# EAGLE design humidor_controller_v35 (EAGLE 6.2)
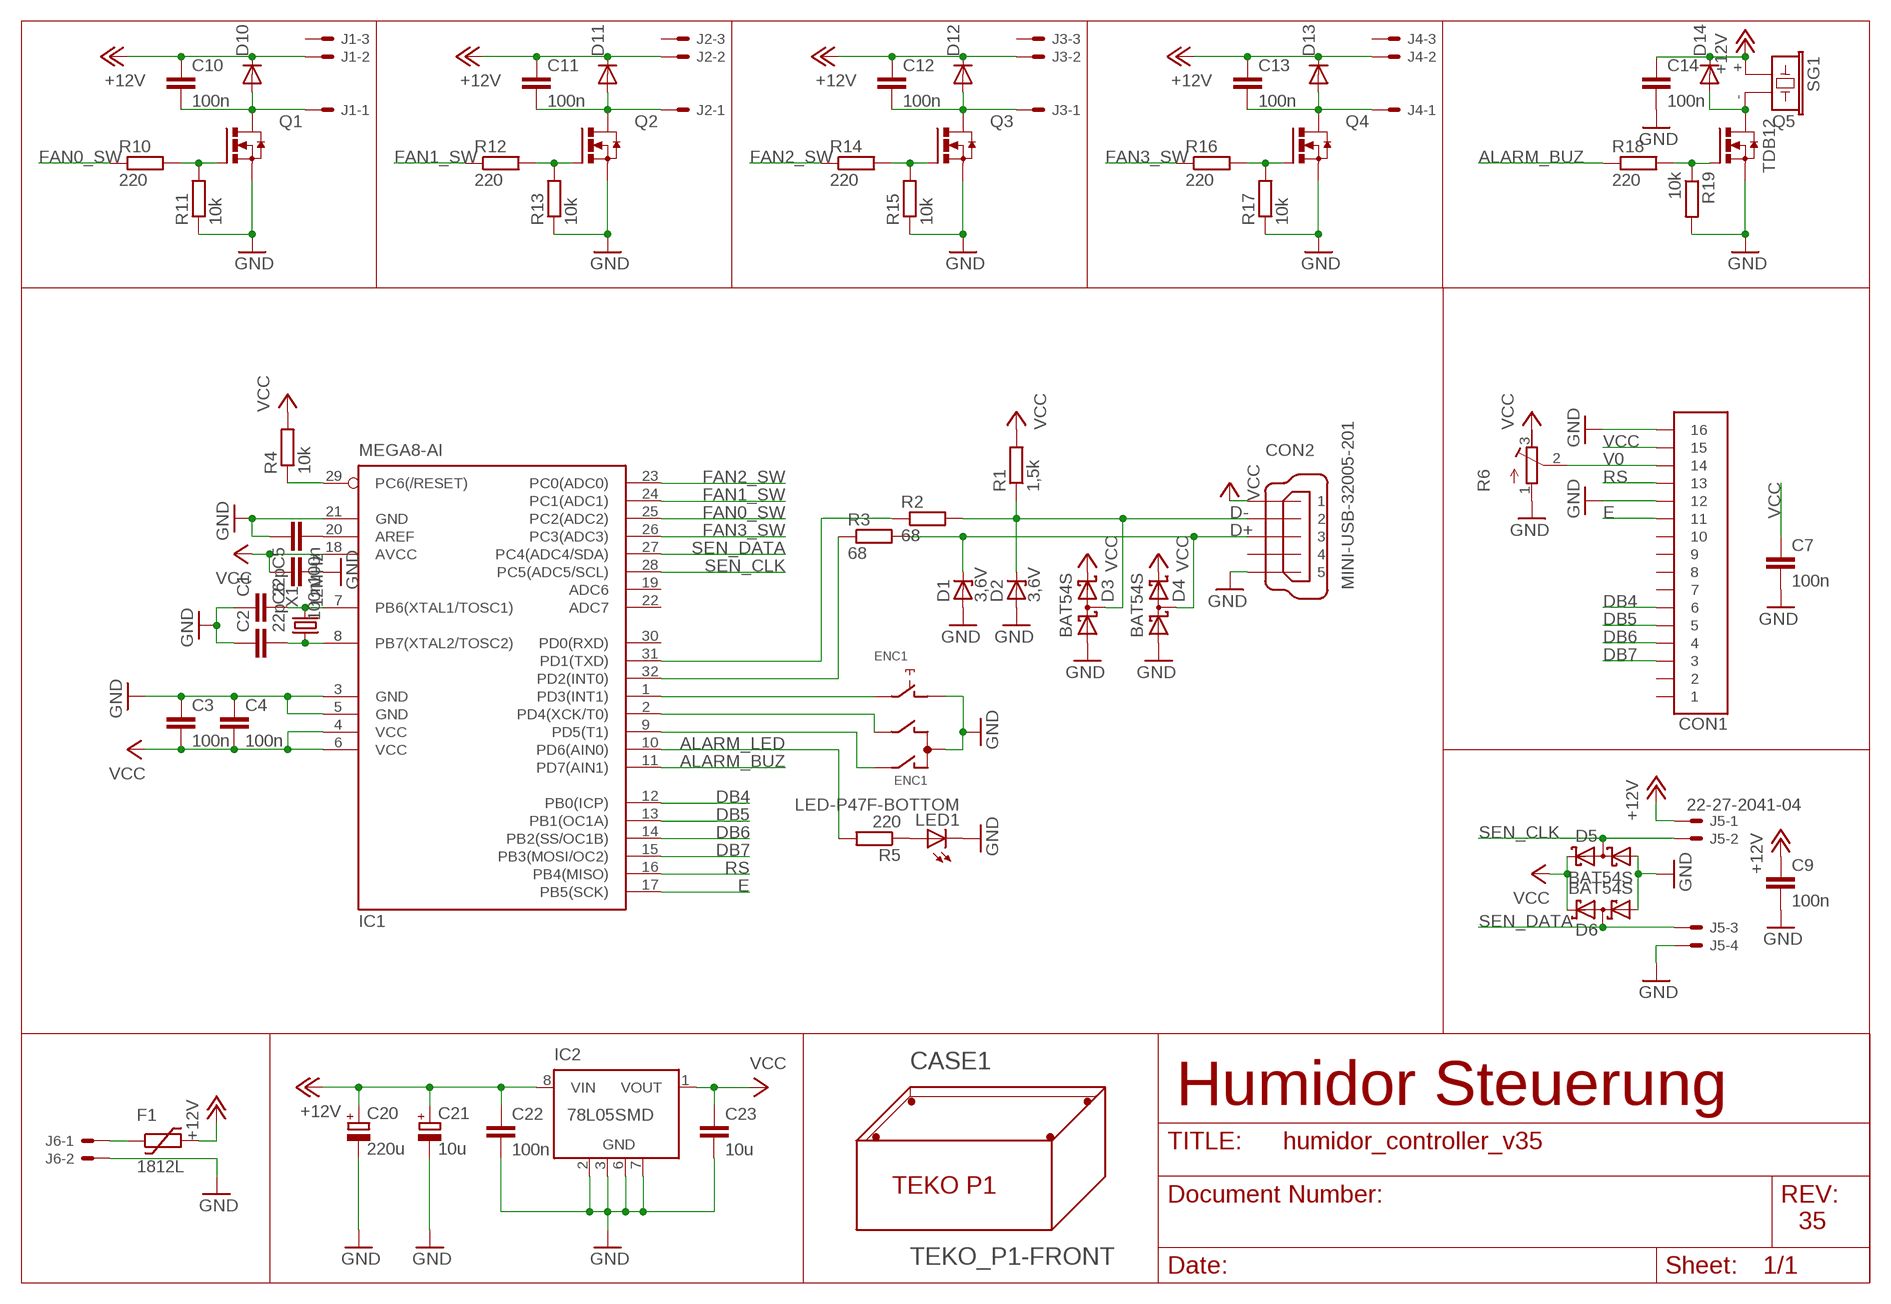
[diagram p0: schematic, sheet 1]

## Parts
C1  22p  C-EUC0805  [C0805]
C2  22p  C-EUC0805  [C0805]
C3  100n  C-EUC0805  [C0805]
C4  100n  C-EUC0805  [C0805]
C5  100n  C-EUC0805  [C0805]
C6  100n  C-EUC0805  [C0805]
C7  100n  C-EUC0805  [C0805]
C9  100n  C-EUC0805  [C0805]
C10  100n  C-EUC0805  [C0805]
C11  100n  C-EUC0805  [C0805]
C12  100n  C-EUC0805  [C0805]
C13  100n  C-EUC0805  [C0805]
C14  100n  C-EUC0805  [C0805]
C20  220u  CPOL-EUG  [PANASONIC_G]
C21  10u  CPOL-EUB  [PANASONIC_B]
C22  100n  C-EUC0805  [C0805]
C23  10u  C-EUC0805  [C0805]
CASE1  TEKO_P1-FRONT  [TEKO_P1_FRONT]
CON1  52207-16  [52207-16]
CON2  MINI-USB-32005-201  [32005-201]
D1  3,6V  ZENER-DIODESOD80C  [SOD80C]
D2  3,6V  ZENER-DIODESOD80C  [SOD80C]
D3  BAT54S  [SOT23]
D4  BAT54S  [SOT23]
D5  BAT54S  [SOT23]
D6  BAT54S  [SOT23]
D10  DIODE-SOD123  [SOD123]
D11  DIODE-SOD123  [SOD123]
D12  DIODE-SOD123  [SOD123]
D13  DIODE-SOD123  [SOD123]
D14  DIODE-SOD123  [SOD123]
ENC1  NOBLE_RE0124  [RE0124]
F1  1812L  [1812L]
IC1  MEGA8-AI  [TQFP32-08]
IC2  78L05SMD  [SO08]
J1  22-27-2031-03  [6410-03]
J2  22-27-2031-03  [6410-03]
J3  22-27-2031-03  [6410-03]
J4  22-27-2031-03  [6410-03]
J5  22-27-2041-04  [6410-04]
J6  22-27-2021-02  [6410-02]
LED1  LED-P47F-BOTTOM  [P47F-BOTTOM]
Q1  N-HEXFET_SOT23-IRLML2502  [SOT23]
Q2  N-HEXFET_SOT23-IRLML2502  [SOT23]
Q3  N-HEXFET_SOT23-IRLML2502  [SOT23]
Q4  N-HEXFET_SOT23-IRLML2502  [SOT23]
Q5  N-HEXFET_SOT23-IRLML2502  [SOT23]
R1  1,5k  R-EU_R0805  [R0805]
R2  68  R-EU_R0805  [R0805]
R3  68  R-EU_R0805  [R0805]
R4  10k  R-EU_R0805  [R0805]
R5  220  R-EU_R0805  [R0805]
R6  R-TRIMM4G/J  [RTRIM4G/J]
R10  220  R-EU_R0805  [R0805]
R11  10k  R-EU_R0805  [R0805]
R12  220  R-EU_R0805  [R0805]
R13  10k  R-EU_R0805  [R0805]
R14  220  R-EU_R0805  [R0805]
R15  10k  R-EU_R0805  [R0805]
R16  220  R-EU_R0805  [R0805]
R17  10k  R-EU_R0805  [R0805]
R18  220  R-EU_R0805  [R0805]
R19  10k  R-EU_R0805  [R0805]
SG1  TDB12  [TDB]
X1  12MHz  CRYSTALHC49UP  [HC49UP]

## Nets
+12V: C9.1 C10.1 C11.1 C12.1 C13.1 C14.1 C20.+ C21.+ C22.1 D10.C D11.C D12.C D13.C D14.C F1.P$2 IC2.8(VIN) J1.2 J2.2 J3.2 J4.2 J5.1 SG1.+
ALARM_BUZ: IC1.11(PD7(AIN1)) R18.1
ALARM_LED: IC1.10(PD6(AIN0)) R5.2
D+: CON2.3 D1.C D4.3(C1A2) R3.2
D-: CON2.2 D2.C D3.3(C1A2) R1.1 R2.2
DB4: CON1.6 IC1.12(PB0(ICP))
DB5: CON1.5 IC1.13(PB1(OC1A))
DB6: CON1.4 IC1.14(PB2(SS/OC1B))
DB7: CON1.3 IC1.15(PB3(MOSI/OC2))
E: CON1.11 IC1.17(PB5(SCK))
FAN0_CS: C10.2 D10.A J1.1 Q1.3(D)
FAN0_SW: IC1.25(PC2(ADC2)) R10.1
FAN1_CS: C11.2 D11.A J2.1 Q2.3(D)
FAN1_SW: IC1.24(PC1(ADC1)) R12.1
FAN2_CS: C12.2 D12.A J3.1 Q3.3(D)
FAN2_CS1: C13.2 D13.A J4.1 Q4.3(D)
FAN2_SW: IC1.23(PC0(ADC0)) R14.1
FAN3_SW: IC1.26(PC3(ADC3)) R16.1
GND: C1.1 C2.1 C3.1 C4.1 C5.1 C6.2 C7.2 C9.2 C14.2 C20.- C21.- C22.2 C23.2 CON1.12 CON1.16 CON2.5 D1.A D2.A D3.1(A1) D4.1(A1) D5.1(A1) D6.1(A1) ENC1.+ ENC1.C IC1.3(GND) IC1.5(GND) IC1.21(GND) IC2.2(GND) IC2.3(GND) IC2.6(GND) IC2.7(GND) J5.4 J6.2 LED1.C Q1.2(S) Q2.2(S) Q3.2(S) Q4.2(S) Q5.2(S) R6.1(E) R11.1 R13.1 R15.1 R17.1 R19.2
N$1: IC1.29(PC6(/RESET)) R4.1
N$2: C2.2 IC1.8(PB7(XTAL2/TOSC2)) X1.1
N$3: C1.2 IC1.7(PB6(XTAL1/TOSC1)) X1.2
N$4: Q2.1(G) R12.2 R13.2
N$5: Q3.1(G) R14.2 R15.2
N$6: Q4.1(G) R16.2 R17.2
N$7: C5.2 IC1.20(AREF)
N$8: LED1.A R5.1
N$9: Q1.1(G) R10.2 R11.2
N$11: IC1.31(PD1(TXD)) R2.1
N$12: F1.P$1 J6.1
N$13: ENC1.- IC1.1(PD3(INT1))
N$14: ENC1.B IC1.2(PD4(XCK/T0))
N$15: ENC1.A IC1.9(PD5(T1))
N$16: IC1.32(PD2(INT0)) R3.1
N$17: D14.A Q5.3(D) SG1.-
N$20: Q5.1(G) R18.2 R19.1
RS: CON1.13 IC1.16(PB4(MISO))
SEN_CLK: D5.3(C1A2) IC1.28(PC5(ADC5/SCL)) J5.2
SEN_DATA: D6.3(C1A2) IC1.27(PC4(ADC4/SDA)) J5.3
V0: CON1.14 R6.2(S)
VCC: C3.2 C4.2 C6.1 C7.1 C23.1 CON1.15 CON2.1 D3.2(C2) D4.2(C2) D5.2(C2) D6.2(C2) IC1.4(VCC) IC1.6(VCC) IC1.18(AVCC) IC2.1(VOUT) R1.2 R4.2 R6.3(A)
Unconnected: CON1.1 CON1.2 CON1.7 CON1.8 CON1.9 CON1.10 CON2.4 IC1.19(ADC6) IC1.22(ADC7) IC1.30(PD0(RXD)) IC2.4(NC) IC2.5(NC) J1.3 J2.3 J3.3 J4.3

## Notes on the sheet
- Humidor Steuerung
- 35

## Library data of the parts
C1 C2 C22 C23 = rcl:C-EU: CAPACITOR, European symbol
C3-C7 C9-C14 = resistor:C-EU: CAPACITOR, European symbol
C20 C21 = rcl:CPOL-EU: POLARIZED CAPACITOR, European symbol
CASE1 = ferdinandkeil:TEKO_P1-: TEKO P1 Case - Serie Optative 85 x 56 x 35 mm
CON1 = ferdinandkeil:52207-16: Molex 52207-16 top-connection FPC 1mm
CON2 = con-cypressindustries:MINI-USB-: MINI USB-B Conector Source: www.cypressindustries.com
D1 D2 = diode:ZENER-DIODE: Z-Diode
D3-D6 = diode:BAT54S: Schottky Diodes Pin connection corrected 2011-05-04 Source: Fairchild .. BAT54.pdf
D10-D14 = ferdinandkeil:DIODE-: DIODE
ENC1 = ferdinandkeil:NOBLE_RE0124: NOBLE RE0124 Rotary Encoder w/ Push-Button
F1 = ferdinandkeil:1812L
IC1 = atmel:MEGA8: MICROCONTROLLER 8 Kbytes FLASH, 1 kbytes SRAM, 512 bytes EEPROM, USART, 6-channel 10 bit ADC, 2-channel 8 bit ADC Pin compatible with Atmega48, ATMega88, ATMega168 Source: avr.lbr
IC2 = linear:78L*SMD: Positive VOLTAGE REGULATOR
J1-J4 = ferdinandkeil:22-?-03: CONNECTOR wire to board 2.54 mm (.1 inch) pitch header; OC_FARNELL: unknown; OC_NEWARK: unknown
J5 = ferdinandkeil:22-?-04: CONNECTOR wire to board 2.54 mm (.1 inch) pitch header; OC_FARNELL: unknown; OC_NEWARK: unknown
J6 = ferdinandkeil:22-?-02: CONNECTOR wire to board 2.54 mm (.1 inch) pitch header; OC_FARNELL: unknown; OC_NEWARK: unknown
LED1 = ferdinandkeil:LED: LED
Q1-Q5 = ferdinandkeil:N-HEXFET_?-*: HEXFET® Power MOSFET
R1-R5 R10-R19 = resistor:R-EU_: RESISTOR, European symbol
R6 = rcl:R-TRIMM: Trimm resistor
SG1 = ferdinandkeil:TDB: TDB Series Buzzer Source: http://www.challengeelectronics.com/.../CEEB12A095-205C23P7.6LR.pdf <http://www.challengeelectronics.com/downloads/buzzers/electromagnetic_thru_hole/CEEB12A095-205C23P7.6LR.pdf>
X1 = crystal:CRYSTAL: CRYSTAL

## Board
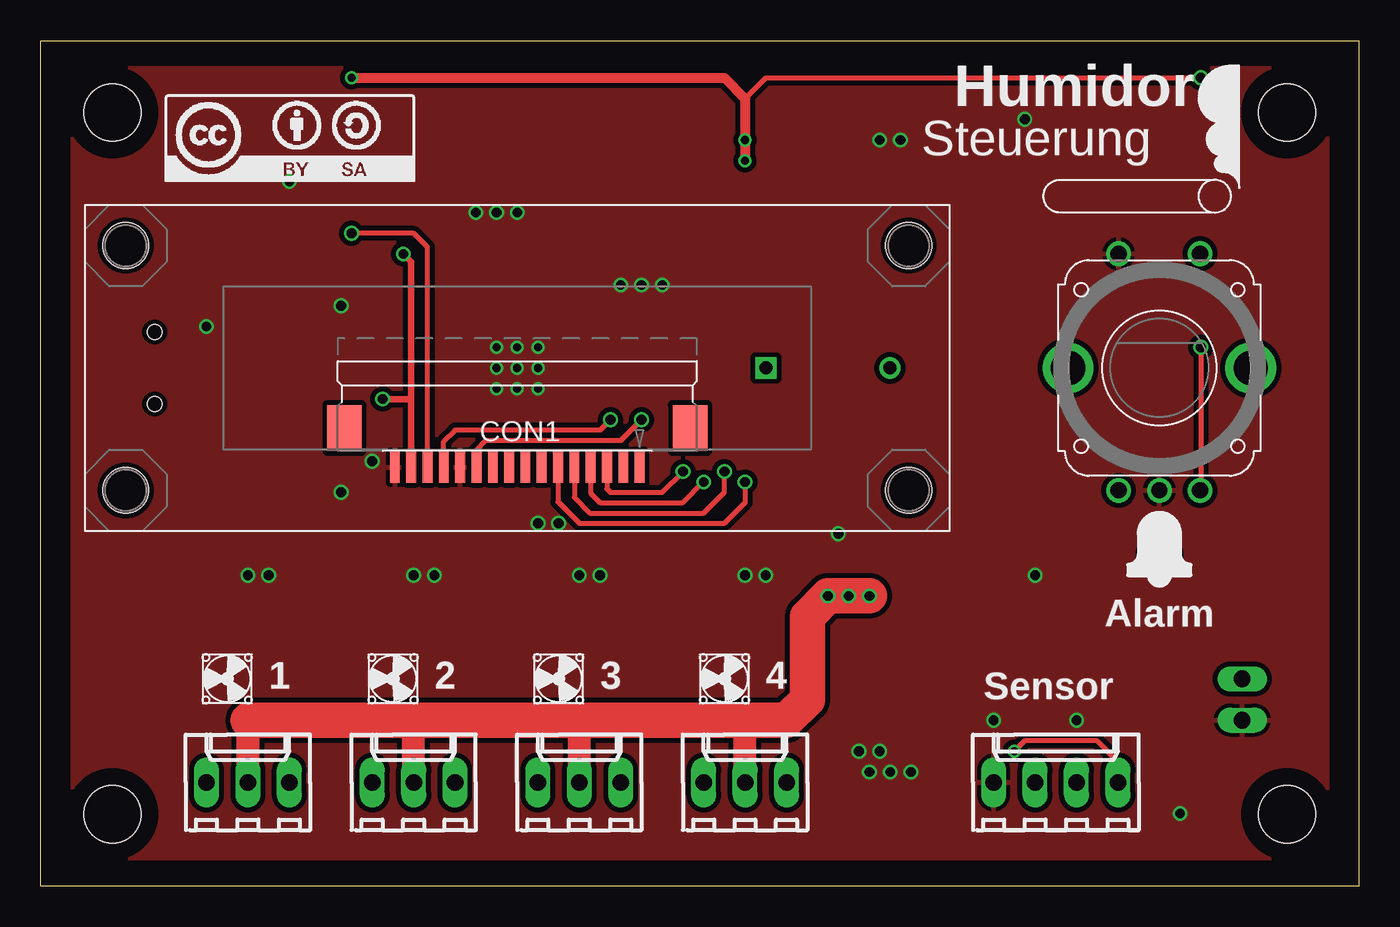
[diagram p1: board, top side]
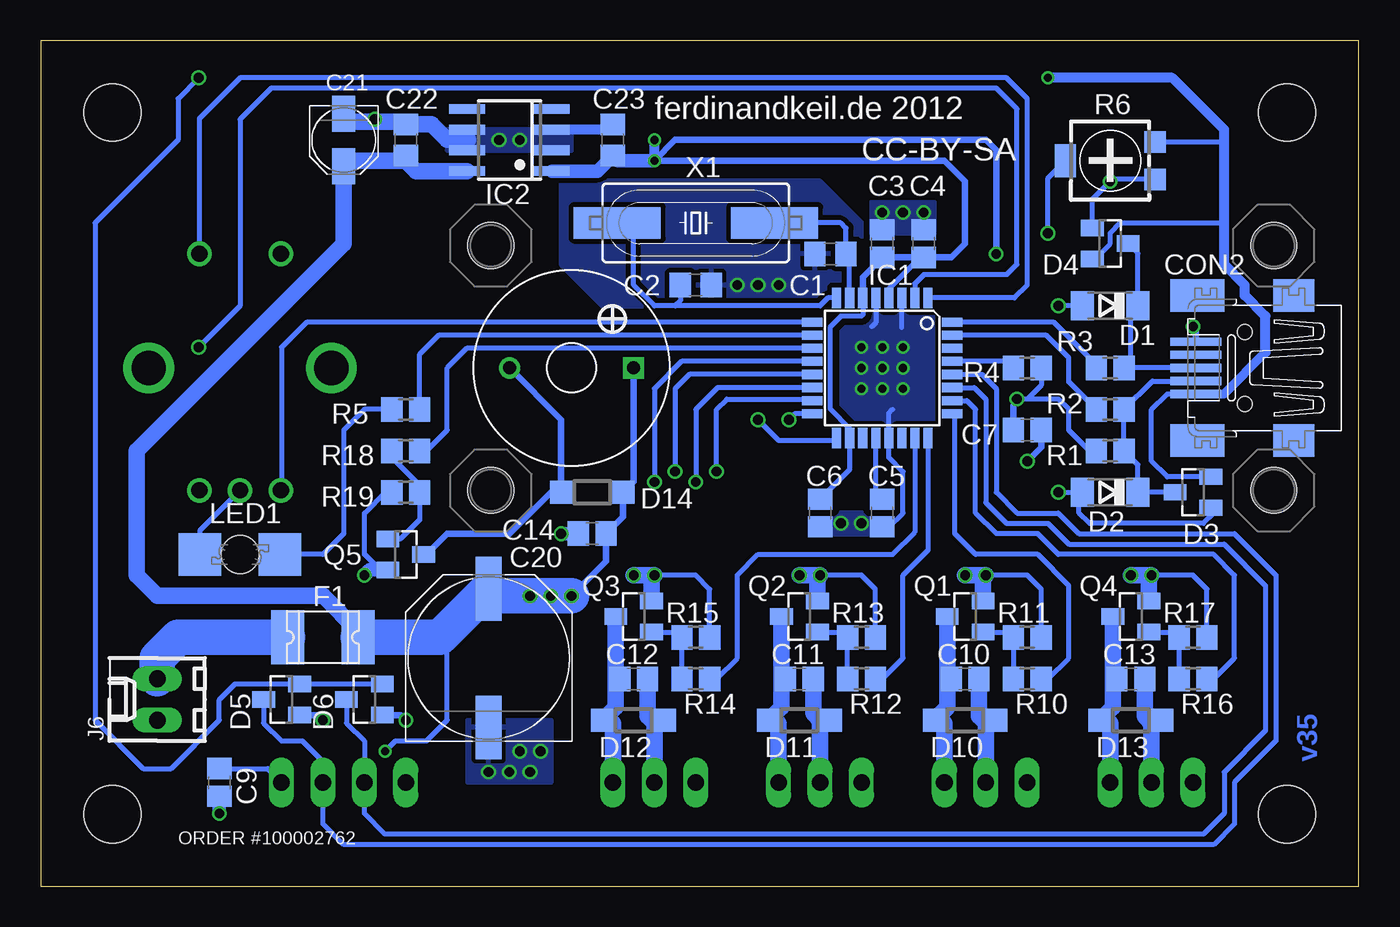
[diagram p2: board, bottom side, seen from below]

Size 80.8 x 51.8 mm. Coordinates in mm from the lower left corner, seen from the top.
Copper layers (1*16): Top 0.035mm / dielectric 1.5mm / Bottom 0.035mm
Design rules: minimum track width 6mil, minimum drill 12mil, track to track 6mil, track to pad 6mil, pad to pad 6mil, via to via 6mil, smd to smd 0mil, copper to edge 10mil, drill to drill 10mil, minimum pad ring 10mil, minimum via ring 6mil, stop-mask expansion 2mil, vias tented up to drill 100mil, thermal gap 10mil

### Footprints (pad centres in the part's own frame; a part is rotated, then mirrored left to right if it is on the bottom)
C0805 = smd 1.3 x 1.5: 1 -0.95,0; 2 0.95,0
C0805' = smd 1.3 x 1.5: 1 -0.85,0; 2 0.85,0
PANASONIC_G = smd 3.9 x 1.6: + 4.25,0; - -4.25,0
PANASONIC_B = smd 2.2 x 1.4: + 1.6,0; - -1.6,0
TEKO_P1_FRONT = hole 3.5: 4.4,4.4; 4.4,47.4; 76.4,4.4; 76.4,47.4
52207-16 = smd 0.6 x 1.9: 1 -7.5,1; 2 -6.5,1; 3 -5.5,1; 4 -4.5,1; 5 -3.5,1; 6 -2.5,1; 7 -1.5,1; 8 -0.5,1; 9 0.5,1; 10 1.5,1; 11 2.5,1; 12 3.5,1; 13 4.5,1; 14 5.5,1; 15 6.5,1; 16 7.5,1 | smd 2.1 x 2.8: P$1 -10.6,-1.4; P$2 10.6,-1.4
32005-201 = smd 3.1 x 0.5: 1 3,1.6; 2 3,0.8; 3 3,0; 4 3,-0.8; 5 3,-1.6 | smd 2.5 x 2: M1 -3,-4.45; M2 -3,4.45 | smd 3.3 x 2: M3 2.9,4.45; M4 2.9,-4.45 | hole 0.9: 0,2.2; 0,-2.2
SOD80C = smd 1.4 x 1.8: A 1.7,0; C -1.7,0
SOT23 = smd 1 x 1.4: 1 -0.95,-1.1; 2 0.95,-1.1; 3 0,1.1
SOD123 = smd 1.4 x 1.4: A 1.9,0; C -1.9,0
RE0124 = drill 1: + -2.5,7; - 2.5,7; A -2.5,-7.5; B 2.5,-7.5; C 0,-7.5 | drill 2.1: P$1 5.6,0; P$2 -5.6,0
1812L = smd 2.03 x 3.3: P$1 -2.16,0; P$2 2.16,0
TQFP32-08 = smd 1.27 x 0.559: 1 -4.293,2.8; 2 -4.293,2; 3 -4.293,1.2; 4 -4.293,0.4; 5 -4.293,-0.4; 6 -4.293,-1.2; 7 -4.293,-2; 8 -4.293,-2.8; 17 4.293,-2.8; 18 4.293,-2; 19 4.293,-1.2; 20 4.293,-0.4; 21 4.293,0.4; 22 4.293,1.2; 23 4.293,2; 24 4.293,2.8 | smd 0.559 x 1.27: 9 -2.8,-4.293; 10 -2,-4.293; 11 -1.2,-4.293; 12 -0.4,-4.293; 13 0.4,-4.293; 14 1.2,-4.293; 15 2,-4.293; 16 2.8,-4.293; 25 2.8,4.293; 26 2,4.293; 27 1.2,4.293; 28 0.4,4.293; 29 -0.4,4.293; 30 -1.2,4.293; 31 -2,4.293; 32 -2.8,4.293
SO08 = smd 0.6 x 2.2: 1 -1.905,-2.6; 2 -0.635,-2.6; 3 0.635,-2.6; 4 1.905,-2.6; 5 1.905,2.6; 6 0.635,2.6; 7 -0.635,2.6; 8 -1.905,2.6
6410-03 = drill 1.016 long: 1 2.54,0; 2 0,0; 3 -2.54,0
6410-04 = drill 1.016 long: 1 3.81,0; 2 1.27,0; 3 -1.27,0; 4 -3.81,0
6410-02 = drill 1.016 long: 1 1.27,0; 2 -1.27,0
P47F-BOTTOM = smd 2.6 x 2.6: A -2.45,0; C 2.45,0 | hole 2.3: 0,0
R0805 = smd 1.3 x 1.5: 1 -0.85,0; 2 0.85,0
RTRIM4G/J = smd 1.3 x 1.3: 1 -1.15,-2.75; 3 1.15,-2.75 | smd 2 x 1.3: 2 0,2.75
TDB = drill 0.8 square: + 3.8,0 | drill 0.8: - -3.8,0
LCD_HMC16223SG = hole 2.8: -24,-7.5; -24,7.5; 24,7.5; 24,-7.5
HC49UP = smd 5.334 x 1.93: 1 -4.826,0; 2 4.826,0

### Placement (x,y rotation side)
C1  32.38,38.73 0 bottom
C2  40.64,36.83 180 bottom
C3  100n  [C0805']  29.21,39.37 270 bottom
C4  100n  [C0805']  26.67,39.37 270 bottom
C5  100n  [C0805']  29.21,22.86 90 bottom
C6  100n  [C0805']  33.02,22.86 270 bottom
C7  100n  [C0805']  20.32,27.94 0 bottom
C9  100n  [C0805']  69.85,6.35 270 bottom
C10  100n  [C0805']  24.13,12.7 180 bottom
C11  100n  [C0805']  34.29,12.7 180 bottom
C12  100n  [C0805']  44.45,12.7 180 bottom
C13  100n  [C0805']  13.97,12.7 180 bottom
C14  100n  [C0805']  46.99,21.59 180 bottom
C20  53.34,13.97 90 bottom
C21  62.23,45.72 270 bottom
C22  58.42,45.72 90 bottom
C23  45.72,45.72 90 bottom
CASE1  0,0 0 top
CON1  29.21,26.67 180 top
CON2  6.99,31.75 180 bottom
D1  15.24,35.56 180 bottom
D2  15.24,24.13 180 bottom
D3  10.16,24.13 90 bottom
D4  15.24,39.37 270 bottom
D5  66.04,11.43 90 bottom
D6  60.96,11.43 90 bottom
D10  24.13,10.16 180 bottom
D11  34.29,10.16 180 bottom
D12  44.45,10.16 180 bottom
D13  13.97,10.16 180 bottom
D14  46.99,24.13 180 bottom
ENC1  68.58,31.75 0 top
F1  63.5,15.24 0 bottom
IC1  29.21,31.75 270 bottom
IC2  52.07,45.72 90 bottom
J1  22.86,6.35 0 top
J2  33.02,6.35 0 top
J3  43.18,6.35 0 top
J4  12.7,6.35 0 top
J5  62.23,6.35 0 top
J6  73.66,11.43 90 bottom
LED1  68.58,20.32 180 bottom
Q1  24.13,16.51 90 bottom
Q2  34.29,16.51 90 bottom
Q3  44.45,16.51 90 bottom
Q4  13.97,16.51 90 bottom
Q5  58.42,20.32 270 bottom
R1  15.24,26.67 180 bottom
R2  15.24,29.21 0 bottom
R3  15.24,31.75 0 bottom
R4  20.32,31.75 0 bottom
R5  58.42,29.21 0 bottom
R6  15.24,44.45 90 bottom
R10  20.32,12.7 180 bottom
R11  20.32,15.24 180 bottom
R12  30.48,12.7 180 bottom
R13  30.48,15.24 180 bottom
R14  40.64,12.7 180 bottom
R15  40.64,15.24 180 bottom
R16  10.16,12.7 180 bottom
R17  10.16,15.24 180 bottom
R18  58.42,26.67 180 bottom
R19  58.42,24.13 180 bottom
SG1  48.26,31.75 0 bottom
U$1  [LCD_HMC16223SG]  29.21,31.75 0 top
U$2  [CC-BY-SA]  7.62,43.18 0 top
U$3  [ICON_LOGO_HUMI_CONTR]  53.98,41.27 0 top
U$4  [ICON_FAN_3X3MM]  21.59,12.7 90 top
U$5  [ICON_FAN_3X3MM]  11.43,12.7 90 top
U$6  [ICON_FAN_3X3MM]  31.75,12.7 90 top
U$7  [ICON_FAN_3X3MM]  41.91,12.7 90 top
X1  40.64,40.64 0 bottom

### Tracks (layer width: path | path; a pad name or v marks a point on that pad's centre or on a via)
+12V  (via drill 0.5, 0.6)
  Top 0.305: J5.1 66.04,7.62 64.77,8.89 60.33,8.89 v59.69,8.26
  Top 1.422: J1.2 22.86,10.16 | J2.2 33.02,10.16 | J3.2 43.18,10.16 | J4.2 12.7,10.16
  Top 2.184: 12.7,10.16 22.86,10.16 33.02,10.16 43.18,10.16 45.72,10.16 46.99,11.43 46.99,16.51 v48.26,17.78 v49.53,17.78 v50.8,17.78
  Bottom 0.305: C9.1 66.89,7.2 J5.1 | v59.69,8.26 59.05,8.89 57.15,8.89 55.88,10.16 55.88,15.24 56.1,15.46
  Bottom 0.406: SG1.+ 44.46,24.77 D14.C 45.09,22.64 C14.1 46.14,19.9 v48.26,17.78
  Bottom 1.016: C22.1 58.42,44.45 | J4.2 12.7,9.99 | J1.2 22.86,9.99 | 22.86,9.99 D10.C | J2.2 33.02,9.99 | 33.02,9.99 D11.C | J3.2 43.18,9.99 | 43.18,9.99 D12.C | 12.7,9.99 D13.C | IC2.8 57.78,43.81 58.42,44.45 | F1.P$2 61.34,15.62 63.5,17.78 73.66,17.78 74.93,19.05 74.93,26.67 62.23,39.37 C21.+ 61.9,44.45 58.42,44.45 | C10.1 23.28,10.41 22.86,9.99 | C11.1 33.44,10.58 33.02,10.16 33.02,9.99 | C12.1 43.6,10.41 43.18,9.99 | C13.1 13.12,10.41 12.7,9.99
  Bottom 2.184: v48.26,17.78 v49.53,17.78 v50.8,17.78 52.9,17.78 C20.+ 56.1,15.46 56.32,15.24 F1.P$2
ALARM_BUZ
  Bottom 0.305: R18.1 57.15,26.67 55.88,27.94 55.88,31.75 54.68,32.95 IC1.11
ALARM_LED
  Bottom 0.305: IC1.10 56.42,33.75 57.57,32.6 R5.2
D+
  Bottom 0.305: CON2.3 13.97,31.75 | R3.2 13.97,31.75 | 13.97,31.75 13.97,35.13 D1.C 13.54,38.77 D4.3
D-
  Bottom 0.305: CON2.2 12.65,30.95 R2.2 R1.1 13.54,25.82 D2.C D3.3
DB4  (via drill 0.6)
  Top 0.305: v43.18,24.77 43.18,23.5 41.91,22.23 33.02,22.23 31.71,23.54 CON1.6
  Bottom 0.305: IC1.12 41.51,32.15 43.18,30.48 v43.18,24.77
DB5  (via drill 0.6)
  Top 0.305: CON1.5 32.71,23.8 33.66,22.86 40.64,22.86 41.91,24.13 v41.91,25.4
  Bottom 0.305: IC1.13 41.04,31.35 41.91,30.48 v41.91,25.4
DB6  (via drill 0.6)
  Top 0.305: CON1.4 33.71,24.07 34.29,23.5 39.37,23.5 v40.64,24.77
  Bottom 0.305: IC1.14 39.3,30.55 40.64,29.21 v40.64,24.77
DB7  (via drill 0.6)
  Top 0.305: CON1.3 34.71,24.34 34.92,24.13 38.1,24.13 v39.37,25.4
  Bottom 0.305: v39.37,25.4 39.37,29.21 38.73,29.84 33.6,29.84 IC1.15
E  (via drill 0.6)
  Top 0.305: CON1.11 26.71,26.71 27.3,27.3 35.56,27.3 v36.83,28.57
  Bottom 0.305: v36.83,28.57 35.56,27.3 32.16,27.3 IC1.17
FAN0_CS
  Bottom 0.305: Q1.3 25.4,16.68
  Bottom 1.016: J1.1 25.4,9.99 D10.A 25.23,10.96 25.23,12.7 | 25.23,12.7 Q1.3 | 25.23,12.7 C10.2
FAN0_SW
  Bottom 0.305: R10.1 19.05,12.7 17.78,13.97 17.78,18.41 19.68,20.32 23.5,20.32 24.77,21.59 24.77,28.8 IC1.25
FAN1_CS
  Bottom 1.016: J2.1 35.56,9.99 D11.A 35.39,10.96 35.39,12.7 | 35.39,12.7 Q2.3 | 35.39,12.7 C11.2
FAN1_SW
  Bottom 0.305: R12.1 29.21,12.7 27.94,13.97 27.94,19.05 26.41,20.58 IC1.24
FAN2_CS
  Bottom 1.016: J3.1 45.72,9.99 D12.A 45.55,10.96 45.55,12.7 | 45.55,12.7 Q3.3 | 45.55,12.7 C12.2
FAN2_CS1
  Bottom 1.016: Q4.3 15.07,12.7 | J4.1 15.24,9.99 D13.A 15.07,10.96 15.07,12.7 | C13.2 15.07,12.7
FAN2_SW
  Bottom 0.305: R14.1 39.37,12.7 38.1,13.97 38.1,19.05 36.83,20.32 28.57,20.32 27.21,21.68 IC1.23
FAN3_SW
  Bottom 0.305: R16.1 8.89,12.7 7.62,13.97 7.62,19.05 8.89,20.32 18.41,20.32 19.68,21.59 22.23,21.59 23.5,22.86 23.5,29.21 24.04,29.75 IC1.26
GND  (via drill 0.5, 0.6)
  Bottom 0.305: C5.1 28.79,22.01 27.94,22.86 27.94,25.4 28.81,26.27 IC1.21 28.81,28.98 28.57,29.21 | 28.01,34.22 IC1.3 | R11.1 19.47,18.2 20.32,19.05 v22.86,19.05 | R13.1 29.63,18.2 30.48,19.05 v33.02,19.05 | R15.1 39.79,18.2 40.64,19.05 v43.18,19.05 | R17.1 9.31,18.2 10.16,19.05 v12.7,19.05 | IC1.5 29.61,34.52 29.84,34.29 | D1.A v18.41,35.56 | v18.41,24.13 D2.A 17.14,23.93 17.14,22.86 16.51,22.23 9.53,22.23 8.89,22.86 9.06,23.03 D3.1 | R19.2 59.69,24.13 60.96,22.86 60.96,20.32 60.01,19.37 | LED1.C 71.03,21.8 ENC1.C | D4.1 16.34,42.08 v15.24,43.18 15.12,43.3 R6.1
  Bottom 0.406: CON2.5 9.98,34.12 v10.16,34.29 | C7.2 19.47,26.89 v20.32,26.04 | D5.1 63.82,10.48 v63.5,10.16 | D6.1 58.74,10.48 v58.42,10.16
  Bottom 0.61: IC2.3 46.03,46.35 C23.2
  Bottom 0.813: C14.2 v48.9,21.59 | v60.96,19.05 60.64,19.37 60.01,19.37 Q5.2 | C9.2 v69.85,4.45
  Bottom 1.016: Q2.2 33.19,18.88 v33.02,19.05 v34.29,19.05 | Q1.2 23.03,18.88 v22.86,19.05 v24.13,19.05 | Q3.2 43.35,18.88 v43.18,19.05 v44.45,19.05 | 54.61,45.72 55.88,45.72 56.83,46.67 C22.2 58.6,46.85 61.76,46.85 C21.- | Q4.2 12.87,18.88 v12.7,19.05 v13.97,19.05
  other vias: 26.67,41.27 27.94,41.27 29.21,41.27 51.44,45.72 52.7,45.72 51.44,8.26 52.07,6.99 53.34,6.99 50.8,6.99 50.16,8.26 30.48,22.23 31.75,22.23 30.48,33.02 29.21,33.02 27.94,33.02 30.48,30.48 30.48,31.75 27.94,31.75 27.94,30.48 29.21,30.48 29.21,31.75 35.56,36.83 36.83,36.83 38.1,36.83 60.33,46.99
  pour Top (isolate 0.305): 0,52.07 81.28,52.07 81.28,0 0,0
  pour Bottom (isolate 0.305, no thermals): 26.04,41.91 26.04,40.01 29.84,40.01 29.84,41.91
  pour Bottom (no thermals): 48.26,46.35 55.88,46.35 55.88,45.09 48.26,45.09
  pour Bottom: 54.61,10.16 49.53,10.16 49.53,6.35 54.61,6.35
  pour Bottom (isolate 0.406, no thermals): 29.21,22.86 33.02,22.86 33.02,21.59 29.21,21.59
  pour Bottom (isolate 0.406): 25.4,35.56 33.02,35.56 33.02,27.94 25.4,27.94
  pour Bottom (isolate 0.305): 30.48,35.56 30.48,40.64 33.02,43.18 48.9,43.18 48.9,38.1 46.35,35.56
N$1
  Bottom 0.305: IC1.29 21.57,32.15 R4.1
N$2
  Bottom 0.305: IC1.8 32.54,36.04 33.02,35.56 41.91,35.56 | 41.91,35.56 43.18,35.56 44.45,36.83 44.45,40.64 X1.1 | C2.2 41.59,35.88 41.91,35.56
N$3
  Bottom 0.305: X1.2 31.75,40.64 31.43,40.33 C1.2 31.21,38.51 IC1.7
N$4
  Bottom 0.305: R12.2 R13.2 31.65,15.56 Q2.1
N$5
  Bottom 0.305: R14.2 R15.2 41.81,15.56 Q3.1
N$6
  Bottom 0.305: Q4.1 11.33,15.56 R17.2 R16.2
N$7
  Bottom 0.305: IC1.20 29.61,24.11 C5.2
N$8
  Bottom 0.305: LED1.A 63.5,20.32 62.23,21.59 62.23,27.94 60.96,29.21 R5.1
N$9
  Bottom 0.305: Q1.1 21.17,15.56 R11.2 R10.2
N$11
  Bottom 0.305: R2.1 17.78,30.9 17.78,32.38 19.14,33.75 IC1.31
N$12
  Bottom 2.184: F1.P$1 72.39,15.24 73.66,13.97 J6.1
N$13
  Bottom 0.305: ENC1.- 71.08,47.03 68.58,49.53 21.59,49.53 20.32,48.26 20.32,36.83 21.11,36.04 IC1.1
N$14  (via drill 0.6)
  Top 0.305: v71.12,33.02 71.12,24.29 ENC1.B
  Bottom 0.305: IC1.2 27.21,36.92 26.67,37.47 21.59,37.47 20.95,38.1 20.95,47.62 22.23,48.9 66.67,48.9 68.58,46.99 68.58,35.56 v71.12,33.02
N$15
  Bottom 0.305: IC1.9 64.51,34.55 66.04,33.02 66.04,24.29 ENC1.A
N$16
  Bottom 0.305: IC1.32 18.68,34.55 16.51,32.38 16.51,32.17 R3.1
N$17
  Bottom 0.406: 57.15,20.32 55.88,21.59 52.07,21.59 49.53,24.13 D14.A 48.89,28.58 SG1.-
  Bottom 0.813: Q5.3 57.15,20.32
N$20
  Bottom 0.305: 59.27,21.27 Q5.1 58.74,21.27 57.57,22.44 R19.1 57.57,24.55 59.27,26.25 R18.2
RS  (via drill 0.6)
  Top 0.305: CON1.13 24.71,27.25 25.4,27.94 34.29,27.94 v34.92,28.57
  Bottom 0.305: IC1.16 34.55,28.95 v34.92,28.57
SEN_CLK
  Bottom 0.305: IC1.28 23.09,31.35 22.23,30.48 22.23,24.13 20.95,22.86 18.41,22.86 17.14,21.59 7.62,21.59 5.08,19.05 5.08,8.89 7.62,6.35 7.62,3.81 8.89,2.54 62.23,2.54 63.5,3.81 J5.2 63.5,7.62 64.77,8.89 66.04,8.89 67.14,9.99 D5.3
SEN_DATA
  Bottom 0.305: IC1.27 23.57,30.55 22.86,29.84 22.86,23.5 21.59,22.23 19.05,22.23 17.78,20.95 8.26,20.95 5.71,18.41 5.71,9.53 8.26,6.99 8.26,4.45 9.53,3.17 59.69,3.17 60.96,4.45 J5.3 60.96,8.89 62.06,9.99 D6.3
V0  (via drill 0.6)
  Top 0.305: CON1.14 23.71,39.16 22.86,40.01 v19.05,40.01
  Bottom 0.305: v19.05,40.01 19.05,43.39 R6.2
VCC  (via drill 0.5, 0.6)
  Top 0.305: v71.12,49.53 44.45,49.53 43.18,48.26
  Top 0.406: CON1.15 22.71,29.84 | 22.71,29.84 22.71,38.25 v22.23,38.73 | v20.95,29.84 22.71,29.84
  Top 0.61: v43.18,44.45 43.18,48.26 41.91,49.53 v19.05,49.53
  Bottom 0.305: v71.12,49.53 72.39,48.26 72.39,45.72 77.47,40.64 77.47,10.16 74.51,7.2 72.81,7.2 69.85,10.16 69.85,11.43 68.9,12.38 D5.2 D6.2 | C6.1 31.21,25.52 IC1.18 31.21,28.04 32.38,29.21 32.38,34.29 31.75,34.92 30.48,34.92 30.41,34.99 IC1.6 | IC1.4 28.81,36.59 27.3,38.1 27.09,38.1 C4.2 | R4.2 19.47,30.7 20.32,29.84 | 20.32,29.84 v20.95,29.84 | R1.2 16.51,26.67 17.78,27.94 17.78,29.21 18.41,29.84 20.32,29.84 | D4.2 16.66,38.1 16.51,38.1 15.24,39.37 15.24,40.01 14.61,40.64 8.26,40.64 | R6.3 8.38,45.6 8.26,45.72 | D3.2 11.74,25.08 12.7,26.04 12.7,29.21 11.76,30.15 CON2.1
  Bottom 0.406: IC1.6 30.41,37.32 C3.2 C4.2 24.98,38.52 24.13,39.37 24.13,43.18 25.4,44.45 v43.18,44.45 41.91,45.72 22.86,45.72 22.23,45.09 v22.23,38.73 | C7.1 21.17,29.43 v20.95,29.84
  Bottom 0.508: CON2.1 8.27,30.15 5.71,32.7
  Bottom 0.61: v43.18,44.45 v43.18,45.72 | v19.05,49.53 11.43,49.53 8.26,46.35 8.26,45.72 8.26,40.64 8.26,38.1 6.99,36.83 6.99,36.2 5.71,34.92 5.71,32.7
  Bottom 0.813: IC2.1 46.67,43.81 C23.1 45.4,44.45 v43.18,44.45

### Text on the board
Bottom: v35
tPlace: Alarm | 1 | 2 | 3 | 4 | Sensor
bPlace: ferdinandkeil.de 2012 | CC-BY-SA | ORDER #100002762
bStop: v35